# Altium project Proximitor Signal Conditioner.PrjPcb
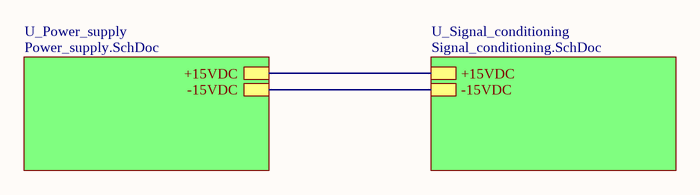
[diagram p0: Proximitor Signal Conditioner.SchDoc]
3 sheets, 63 parts. Net scope: hierarchical (ports join the sheet entries above them; power ports are global).
Board file: Processing_Unit.PcbDoc
Sheets:
  Proximitor Signal Conditioner.SchDoc
    U_Power_supply = Power_supply.SchDoc
    U_Signal_conditioning = Signal_conditioning.SchDoc

## Sheet Proximitor Signal Conditioner.SchDoc
size A4; SheetNumber: 1; SheetTotal: 3

### Sub-sheets
U_Power_supply = Power_supply.SchDoc: +15VDC, -15VDC
U_Signal_conditioning = Signal_conditioning.SchDoc: +15VDC, -15VDC

### Nets
+15VDC: sheet U_Power_supply/+15VDC, sheet U_Signal_conditioning/+15VDC
-15VDC: sheet U_Power_supply/-15VDC, sheet U_Signal_conditioning/-15VDC

## Sheet Power_supply.SchDoc
size A4; SheetNumber: 2; SheetTotal: 3
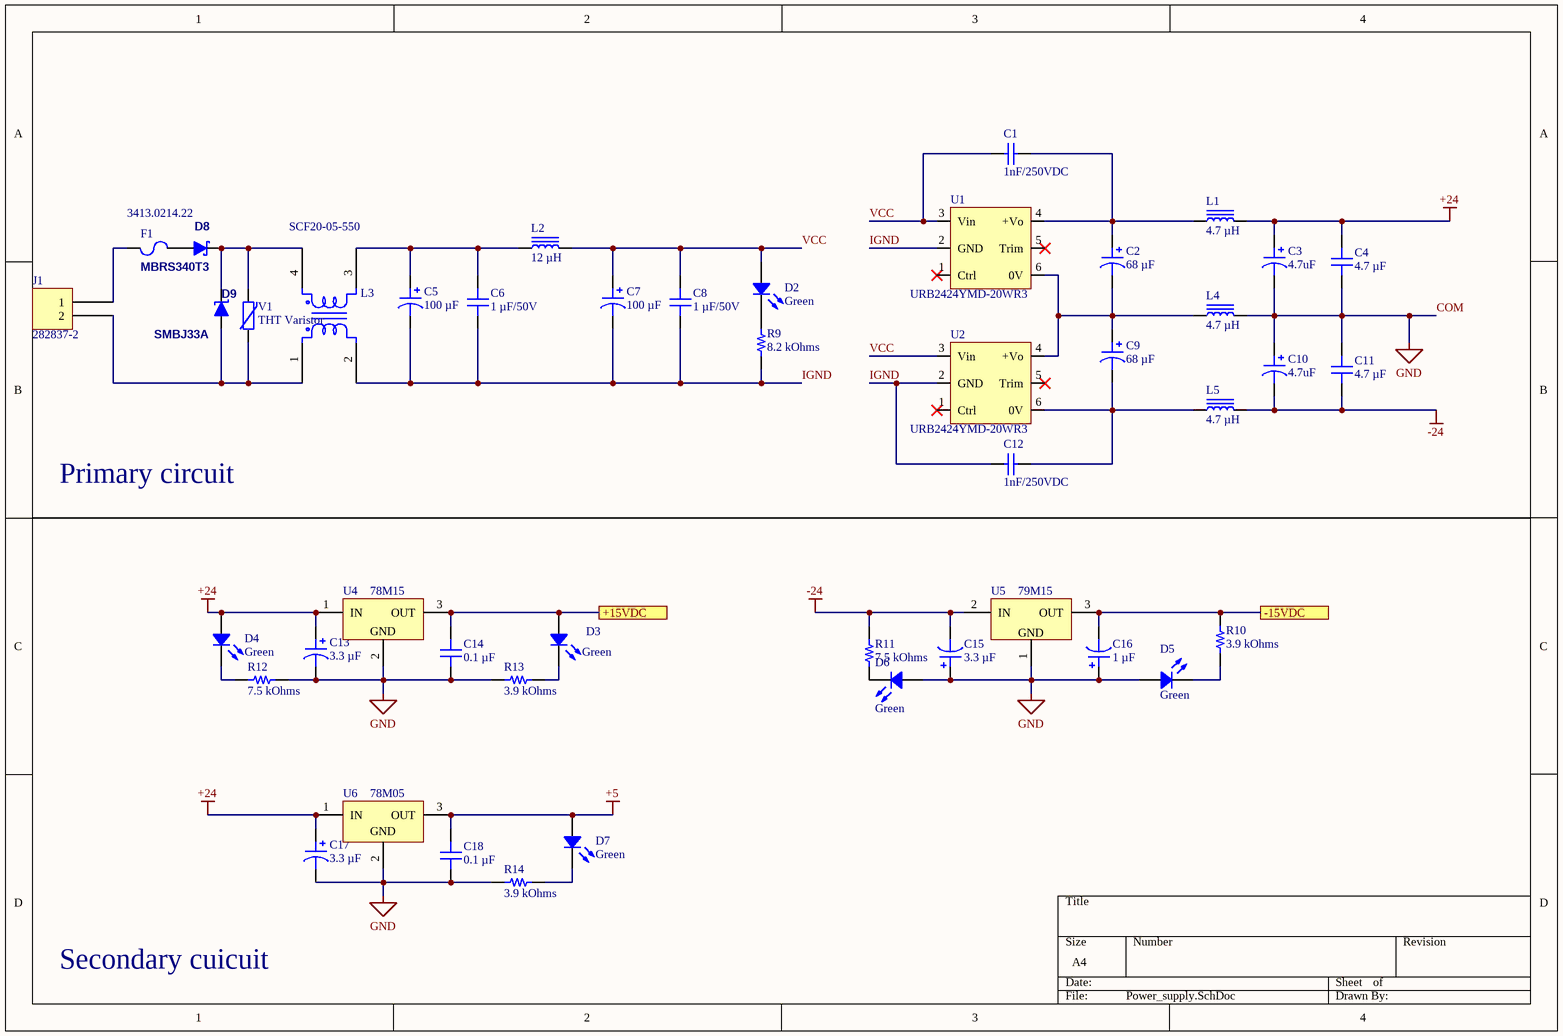
[diagram p1: Power_supply.SchDoc]

### Parts
C1  1nF/250VDC  [SIOV-S07K11]
C2  68 µF  [CAP ALSMD 8.3MM H10.5MM]
C3  4.7uF  [CAP ALSMD 8.3MM H10.5MM]
C4  4.7 µF  [CAP 1210_3225 - 1MM]
C5  100 µF  [CAP ALSMD 8.3MM H10.5MM]
C6  Capacitance: 1 µF/50V  [CAP 1206_3216 - 0.8MM]  (hidden comment: 4.7 µF)
C7  100 µF  [CAP ALSMD 8.3MM H10.5MM]
C8  Capacitance: 1 µF/50V  [CAP 1206_3216 - 0.8MM]  (hidden comment: 4.7 µF)
C9  68 µF  [CAP ALSMD 8.3MM H10.5MM]
C10  4.7uF  [CAP ALSMD 8.3MM H10.5MM]
C11  4.7 µF  [CAP 1210_3225 - 1MM]
C12  1nF/250VDC  [SIOV-S07K11]
C13  3.3 µF  [CAP ALSMD 4.3MM H5.4MM]
C14  0.1 µF  [CAP 0603_1608]
C15  3.3 µF  [CAP ALSMD 4.3MM H5.4MM]
C16  1 µF  [CAP ALSMD 4.3MM H5.4MM]
C17  3.3 µF  [CAP ALSMD 4.3MM H5.4MM]
C18  0.1 µF  [CAP 0603_1608]
D2  Green  [LED 0603_1608 GREEN]
D3  Green  [LED 0603_1608 GREEN]
D4  Green  [LED 0603_1608 GREEN]
D5  Green  [LED 0603_1608 GREEN]
D6  Green  [LED 0603_1608 GREEN]
D7  Green  [LED 0603_1608 GREEN]
D8  MBRS340T3  [SMC]
D9  SMBJ33A  [SMB]
F1  3413.0214.22  [FUSE 1206_3216 0.6MM]
J1  282837-2  [TE 282837-2]
L1  4.7 µH  [BOURNS SRP5030T]
L2  12 µH  [BOURNS SRR1280]
L3  SCF20-05-550  [KEMET SCF20-05-550]
L4  4.7 µH  [BOURNS SRP5030T]
L5  4.7 µH  [BOURNS SRP5030T]
R9  8.2 kOhms  [RES 0805_2012]
R10  3.9 kOhms  [RES 0805_2012]
R11  7.5 kOhms  [RES 0805_2012]
R12  7.5 kOhms  [RES 0805_2012]
R13  3.9 kOhms  [RES 0805_2012]
R14  3.9 kOhms  [RES 0805_2012]
U1  URB2424YMD-20WR3  [URB_YMD-20WR3]
U2  URB2424YMD-20WR3  [URB_YMD-20WR3]
U4  78M15  [TO252]
U5  79M15  [TO252]
U6  78M05  [TO252]
V1  THT Varistor  [SIOV-S07K11]

### Ports
+15VDC, -15VDC

### Nets
+5: C18.2 D7.1 U6.3(OUT)
+24: C3.1 C4.2 C13.1 C17.1 D4.1 L1.2 U4.1(IN) U6.1(IN)
-24: C10.2 C11.1 C15.2 L5.2 R11.2 U5.2(IN)
COM: C3.2 C4.1 C10.1 C11.2 C13.2 C14.1 C15.1 C16.1 C17.2 C18.1 D5.1 D6.1 L4.2 R12.2 R13.1 R14.1 U4.2(GND) U5.1(GND) U6.2(GND)  [also labelled GND]
+15VDC: C14.2 D3.1 U4.3(OUT) ; port +15VDC
-15VDC: C16.2 R10.2 U5.3(OUT) ; port -15VDC
IGND: C5.2 C6.1 C7.2 C8.1 C12.2 L3.2 R9.1 U1.2(GND) U2.2(GND)
VCC: C1.2 C7.1 C8.2 D2.1 L2.2 U1.3(Vin) U2.3(Vin)
NetC1_1: C1.1 C2.1 L1.1 U1.4(+Vo)
NetC2_2: C2.2 C9.1 L4.1 U1.6(0V) U2.4(+Vo)
NetC5_1: C5.1 C6.2 L2.1 L3.3
NetC9_2: C9.2 C12.1 L5.1 U2.6(0V)
NetD2_2: D2.2 R9.2
NetD3_2: D3.2 R13.2
NetD4_2: D4.2 R12.1
NetD5_2: D5.2 R10.1
NetD6_2: D6.2 R11.1
NetD7_2: D7.2 R14.2
NetD8_1: D8.1(A) F1.2
NetD8_2: D8.2(K) D9.2(K) L3.4 V1.2
NetD9_1: D9.1(A) J1.2 L3.1 V1.1
NetF1_1: F1.1 J1.1

Not connected (* = marked no-connect by the designer): U1 1(Ctrl)* 5(Trim)*; U2 1(Ctrl)* 5(Trim)*

### Notes on the sheet
- Primary circuit
- Secondary cuicuit

### Library data of the parts
C1 C12 = Y safety capacitor: pitch 7.5 mm
C2 C9 = 865060653009: CAP ALUM 68UF 20% 50V SMD; manufacturer: Würth Elektronik; Impedance: 340 mOhms; Lifetime @ Temp.: 5000 Hrs @ 105°C; Polarization: Polar; Ripple Current @ High Frequency: 300 mA @ 100 kHz; Ripple Current @ Low Frequency: 195 mA @ 120 Hz; Surface Mount Land Size: 0.327" L x 0.327" W (8.30mm x 8.30mm); Part Number: 865060653009; Applications: General Purpose; Capacitance: 68 µF; componentlink1description: Datasheet; componentlink1url: https://katalog.we-online.de/pbs/datasheet/865060653009.pdf; componentlink2description: DigiKey Link; componentlink2url: https://www.digikey.com/en/products/detail/würth-elektronik/865060653009/5728144; Device Package: Radial, Can - SMD; Height - Seated (Max): 0.413" (10.50mm); lastupdated: 4/5/2026 8:53:58 PM; Lifecycle Status: Active; Minimum Order: 1; Mounting Type: Surface Mount; Operating Temperature: -55°C ~ 105°C; Package / Case: Radial, Can - SMD; packaging: TapeAndReel; partid: 7468; Part Status: Active; price: 0.36; series: WCAP-ASLL; Size / Dimension: 0.315" Dia (8.00mm); Supplier 1: DigiKey; Supplier Part Number 1: 732-8549-1-ND; Tolerance: ±20%; value: 68 µF; Voltage - Rated: 50 V
C3 C10 = UCX1H470MCS1GS: CAP ALUM 47UF 20% 50V SMD; manufacturer: Nichicon; Capacitance: 47µF; ESR (Equivalent Series Resistance): 250mOhm; Lifetime @ Temp.: 2000 Hrs @ 135°C; Polarization: Polar; Ripple Current @ High Frequency: 270mA @ 100kHz; Ripple Current @ Low Frequency: 135mA @ 120Hz; Surface Mount Land Size: 0.327" L x 0.327" W (8.30mm x 8.30mm); value: 47µF; Part Number: UCX1H470MCS1GS; Applications: General Purpose; componentlink1description: Datasheet; componentlink1url: http://nichicon-us.com/english/products/pdfs/e-ucx.pdf; componentlink2description: DigiKey Link; componentlink2url: http://digikey.com/product-detail/en/nichicon/UCX1H470MCS1GS/493-13624-1-ND/4695062; Device Package: Radial, Can - SMD; Height - Seated (Max): 0.413" (10.50mm); lastupdated: 9/2/2020 1:25:13 AM; Lifecycle Status: Active; Minimum Order: 1; Mounting Type: Surface Mount; Operating Temperature: -40°C ~ 135°C; Package / Case: Radial, Can - SMD; packaging: TapeAndReel; partid: 7791; Part Status: Active; price: 0.48; series: UCX; Size / Dimension: 0.315" Dia (8.00mm); Supplier 1: DigiKey; Supplier Part Number 1: 493-13624-1-ND; Tolerance: ±20%; Voltage - Rated: 50V
C4 C11 = CNC6P1X7R2A475K250AE: CAP 1210 X7R 100V 4.7UF 10% 2.50; manufacturer: TDK Corporation; Part Number: CNC6P1X7R2A475K250AE; Value: 4.7 µF; Applications: Boardflex Sensitive; Capacitance: 4.7 µF; componentlink1description: Datasheet; componentlink1url: https://product.tdk.com/info/en/catalog/datasheets/mlcc_commercial_soft_cnc_en.pdf?ref_disty=digikey; componentlink2description: DigiKey Link; componentlink2url: https://www.digikey.com/en/products/detail/tdk-corporation/CNC6P1X7R2A475K250AE/10240634; Device Package: 1210 (3225 Metric); Features: Soft Termination; lastupdated: 4/6/2026 7:45:52 PM; Lifecycle Status: Active; Minimum Order: 1; Mounting Type: Surface Mount, MLCC; Operating Temperature: -55°C ~ 125°C; Package / Case: 1210 (3225 Metric); packaging: TapeAndReel; partid: 23689; Part Status: Active; price: 0.44; series: CNC; Size / Dimension: 0.126" L x 0.098" W (3.20mm x 2.50mm); Supplier 1: DigiKey; Supplier Part Number 1: 445-181657-1-ND; Temperature Coefficient: X7R; Thickness (Max): 0.110" (2.80mm); Tolerance: ±10%; Voltage - Rated: 100V
C5 C7 = UWT1H101MNL1GS: CAP ALUM 100UF 20% 50V SMD; manufacturer: Nichicon; Lifetime @ Temp.: 1000 Hrs @ 105°C; Polarization: Polar; Ripple Current @ High Frequency: 210 mA @ 10 kHz; Ripple Current @ Low Frequency: 140 mA @ 120 Hz; Surface Mount Land Size: 0.327" L x 0.327" W (8.30mm x 8.30mm); Part Number: UWT1H101MNL1GS; Applications: General Purpose; Capacitance: 100 µF; componentlink1description: Datasheet; componentlink1url: https://products.nichicon.co.jp/en/pdf/XJA043/e-uwt.pdf; componentlink2description: DigiKey Link; componentlink2url: https://www.digikey.com/en/products/detail/nichicon/UWT1H101MNL1GS/589967; Device Package: Radial, Can - SMD; Height - Seated (Max): 0.413" (10.50mm); lastupdated: 4/5/2026 8:53:58 PM; Lifecycle Status: Active; Minimum Order: 1; Mounting Type: Surface Mount; Operating Temperature: -55°C ~ 105°C; Package / Case: Radial, Can - SMD; packaging: TapeAndReel; partid: 7453; Part Status: Active; price: 0.12; Ratings: AEC-Q200; series: UWT; Size / Dimension: 0.315" Dia (8.00mm); Supplier 1: DigiKey; Supplier Part Number 1: 493-2226-1-ND; Tolerance: ±20%; value: 100 µF; Voltage - Rated: 50 V
C6 C8 = GRM31CC72A475KE11K: CAP CER 4.7UF 100V X7S 1206; manufacturer: Murata Electronics; Tolerance: ±10%; Part Number: GRM31CC72A475KE11K; Applications: General Purpose; componentlink1description: Datasheet; componentlink1url: https://search.murata.co.jp/Ceramy/image/img/A01X/G101/ENG/GRM31CC72A475KE11-01.pdf; componentlink2description: DigiKey Link; componentlink2url: https://www.digikey.com/en/products/detail/murata-electronics/GRM31CC72A475KE11K/13904926; Device Package: 1206 (3216 Metric); lastupdated: 4/6/2026 7:36:55 PM; Lifecycle Status: Active; Minimum Order: 1; Mounting Type: Surface Mount, MLCC; Operating Temperature: -55°C ~ 125°C; Package / Case: 1206 (3216 Metric); packaging: TapeAndReel; partid: 30045; Part Status: Active; price: 0.19; series: GRM; Size / Dimension: 0.126" L x 0.063" W (3.20mm x 1.60mm); Supplier 1: DigiKey; Supplier Part Number 1: 490-GRM31CC72A475KE11KCT-ND; Temperature Coefficient: X7S; Thickness (Max): 0.075" (1.90mm); value: 4.7 µF; Voltage - Rated: 100V
C13 C15 C17 = EEE-FC1V3R3R: CAP ALUM 3.3UF 20% 35V SMD; manufacturer: Panasonic Electronic Components; Impedance: 3 Ohms; Lifetime @ Temp.: 1000 Hrs @ 105°C; Polarization: Polar; Ripple Current @ High Frequency: 60 mA @ 100 kHz; Ripple Current @ Low Frequency: 45 mA @ 120 Hz; Surface Mount Land Size: 0.169" L x 0.169" W (4.30mm x 4.30mm); Part Number: EEE-FC1V3R3R; Applications: Automotive; Capacitance: 3.3 µF; componentlink1description: Datasheet; componentlink1url: https://industrial.panasonic.com/cdbs/www-data/pdf/RDE0000/ABA0000C1172.pdf; componentlink2description: DigiKey Link; componentlink2url: https://www.digikey.com/en/products/detail/panasonic-electronic-components/EEE-FC1V3R3R/817439; Device Package: Radial, Can - SMD; Height - Seated (Max): 0.213" (5.40mm); lastupdated: 4/5/2026 8:29:52 PM; Lifecycle Status: Active; Minimum Order: 1; Mounting Type: Surface Mount; Operating Temperature: -40°C ~ 105°C; Package / Case: Radial, Can - SMD; packaging: TapeAndReel; partid: 7059; Part Status: Active; price: 0.11; Ratings: AEC-Q200; series: FC; Size / Dimension: 0.157" Dia (4.00mm); Supplier 1: DigiKey; Supplier Part Number 1: PCE4030CT-ND; Tolerance: ±20%; value: 3.3 µF; Voltage - Rated: 35 V
C14 C18 = C0603C104M5RAC7867: CAP CER 0.1UF 50V X7R 0603; manufacturer: KEMET; Tolerance: ±20%; Part Number: C0603C104M5RAC7867; Capacitance: 0.1 µF; Applications: Bypass, Decoupling; componentlink1description: Datasheet; componentlink1url: https://api.kemet.com/component-edge/download/datasheet/C0603C104M5RACTU.pdf; componentlink2description: DigiKey Link; componentlink2url: https://www.digikey.com/en/products/detail/kemet/C0603C104M5RAC7867/2199782; Device Package: 0603 (1608 Metric); lastupdated: 4/6/2026 7:22:26 PM; Lifecycle Status: Active; Minimum Order: 1; Mounting Type: Surface Mount, MLCC; Operating Temperature: -55°C ~ 125°C; Package / Case: 0603 (1608 Metric); packaging: TapeAndReel; partid: 35320; Part Status: Active; price: 0.01; series: SMD Comm X7R; Size / Dimension: 0.063" L x 0.031" W (1.60mm x 0.80mm); Supplier 1: DigiKey; Supplier Part Number 1: 399-C0603C104M5RAC7867CT-ND; Temperature Coefficient: X7R; Thickness (Max): 0.034" (0.87mm); value: 0.1 µF; Voltage - Rated: 50V
C16 = EEE-1HA010NR: CAP ALUM 1UF 20% 50V SMD; manufacturer: Panasonic Electronic Components; Lifetime @ Temp.: 2000 Hrs @ 85°C; Polarization: Bi-Polar; Ripple Current @ High Frequency: 17 mA @ 10 kHz; Ripple Current @ Low Frequency: 10 mA @ 120 Hz; Surface Mount Land Size: 0.169" L x 0.169" W (4.30mm x 4.30mm); Part Number: EEE-1HA010NR; Applications: Automotive; Capacitance: 1 µF; componentlink1description: Datasheet; componentlink1url: //media.digikey.com/pdf/Data%20Sheets/Panasonic%20Electronic%20Components/S_Series,Type_V_Rev2018.pdf; componentlink2description: DigiKey Link; componentlink2url: https://www.digikey.com/en/products/detail/panasonic-electronic-components/EEE-1HA010NR/946216; Device Package: Radial, Can - SMD; Height - Seated (Max): 0.213" (5.40mm); lastupdated: 4/5/2026 8:29:53 PM; Lifecycle Status: Active; Minimum Order: 1; Mounting Type: Surface Mount; Operating Temperature: -40°C ~ 85°C; Package / Case: Radial, Can - SMD; packaging: TapeAndReel; partid: 7035; Part Status: Active; price: 0.07; Ratings: AEC-Q200; series: S; Size / Dimension: 0.157" Dia (4.00mm); Supplier 1: DigiKey; Supplier Part Number 1: PCE4301CT-ND; Tolerance: ±20%; value: 1 µF; Voltage - Rated: 50 V
D2-D7 = LSM0603453V: LED GREEN CLEAR CHIP 0603 SMD; Manufacturer: Visual Communications Company - VCC; Configuration: Standard; Current - Test: 20mA; Lens Color: Colorless; Lens Size: 1.20mm x 0.80mm; Lens Style: Rectangle with Flat Top; Millicandela Rating: 63mcd; Viewing Angle: 120°; Voltage - Forward (Vf) (Typ): 2V; Wavelength - Dominant: 572nm; Wavelength - Peak: 571nm; Part Number: LSM0603453V; Color: Green; ComponentLink1Description: Datasheet; ComponentLink1URL: https://vcclite.com/wp-content/uploads/wpallimport/files/files/LSM0603453V.pdf; ComponentLink2Description: DigiKey Link; ComponentLink2URL: https://www.digikey.com/en/products/detail/visual-communications-company-vcc/LSM0603453V/9486724; Device Package: 0603 (1608 Metric); Height (Max): 0.65mm; LastUpdated: 4/5/2026 20:36:38; Lens Transparency: Clear; Lifecycle Status: Active; Minimum Order: 1; Mounting Type: Surface Mount; Package / Case: 0603 (1608 Metric); Packaging: TapeAndReel; PartId: 579; Part Status: Active; Price: 0.09; Series: LSM0603; Size / Dimension: 1.60mm L x 0.80mm W; Supplier 1: DigiKey; Supplier Part Number 1: LSM0603453VCT-ND; Supplier Device Package: Chip LED; Value: Green
D8 = MBRS340T3: Schottky barrier rectifier: 40V, 3A; Published: 30-Jun-2006; PackageReference: SMC; Supplier 1: TME; Supplier 2: Farnell; Supplier 3: Farnell; Supplier Part Number 1: MBRS340T3; Supplier Part Number 2: 2323112; Supplier Part Number 3: 2323120
D9 = SMBJ33A: 33V, 600W Surface Mount Transient Voltage Suppression Diode, SMBJ Series; Supplier 1: Farnell; Supplier 2: Farnell; Supplier 3: TME; Supplier 4: Farnell; Supplier 5: TME; Supplier 6: Farnell; Supplier 7: Farnell; Supplier Part Number 1: 9886257; Supplier Part Number 2: 2252485; Supplier Part Number 3: SMBJ33A-TR; Supplier Part Number 4: 9886257RL; Supplier Part Number 5: SMBJ33A-LF; Supplier Part Number 6: 9844015; Supplier Part Number 7: 9844015RL
F1 = 3413.0214.22: FUSE BOARD MNT 630MA 32VAC 63VDC; Manufacturer: Schurter Inc.; Approval Agency: cURus, VDE; Breaking Capacity @ Rated Voltage: 63A; Fuse Type: Board Mount (Cartridge Style Excluded); Melting I²t: 0.076; Response Time: Fast Blow; Voltage Rating - AC: 32V; Voltage Rating - DC: 63V; Part Number: 3413.0214.22; Approvals: cURus, VDE; ComponentLink1Description: Datasheet; ComponentLink1URL: https://us.schurter.com/pdf/english/typ_USI_1206.pdf; ComponentLink2Description: DigiKey Link; ComponentLink2URL: http://digikey.com/product-detail/en/schurter-inc/3413.0214.22/486-1142-1-ND/1522974; Current Rating (Amps): 630mA; Device Package: 1206 (3216 Metric); LastUpdated: 9/2/2020 1:30:41 AM; Lifecycle Status: Active; Minimum Order: 1; Mounting Type: Surface Mount; Operating Temperature: -55°C ~ 90°C; Package / Case: 1206 (3216 Metric); Packaging: TapeAndReel; Part Status: Active; Price: 0.26; Series: USI 1206; Size / Dimension: 0.126" L x 0.063" W x 0.024" H (3.20mm x 1.60mm x 0.60mm); Supplier 1: DigiKey; Supplier Part Number 1: 486-1142-1-ND
J1 = 282837-2: TERM BLK 2P SIDE ENT 5.08MM PCB; Manufacturer: TE Connectivity AMP Connectors; Current: 13.5 A; Mating Orientation: Horizontal with Board; Number of Levels: 1; Pitch: 0.200" (5.08mm); Positions Per Level: 2; Voltage: 300 V; Wire Gauge: 16-28 AWG; Wire Termination: Screw - Rising Cage Clamp; Part Number: 282837-2; Color: Green; ComponentLink1Description: Datasheet; ComponentLink1URL: https://www.te.com/commerce/DocumentDelivery/DDEController?Action=srchrtrv&DocNm=282837&DocType=Customer+Drawing&DocLang=English; ComponentLink2Description: DigiKey Link; ComponentLink2URL: https://www.digikey.com/en/products/detail/te-connectivity-amp-connectors/282837-2/2187973; Features: Interlocking (Side); LastUpdated: 6/21/2022 3:00:23 PM; Lifecycle Status: Active; Minimum Order: 1; Mounting Type: Through Hole; Packaging: Tray; Part Status: Active; Price: 0.31; Series: Buchanan; Supplier 1: DigiKey; Supplier Part Number 1: A113320-ND
L1 L4 L5 = SRP5030T-4R7M: FIXED IND 4.7UH 4.6A 53 MOHM SMD; Manufacturer: Bourns Inc.; Current - Saturation: 6A; DC Resistance (DCR): 53mOhm Max; Inductance Frequency - Test: 100 kHz; Material - Core: Iron Powder; Shielding: Shielded; Tolerance: ±20%; Type: Drum Core, Wirewound; Part Number: SRP5030T-4R7M; ComponentLink1Description: Datasheet; ComponentLink1URL: https://www.bourns.com/docs/Product-Datasheets/SRP5030T.pdf; ComponentLink2Description: DigiKey Link; ComponentLink2URL: https://www.digikey.com/en/products/detail/bourns-inc/SRP5030T-4R7M/3986084; Current Rating (Amps): 4.6 A; Device Package: Nonstandard; Height - Seated (Max): 0.118" (3.00mm); Inductance: 4.7 µH; LastUpdated: 4/5/2026 8:41:42 PM; Lifecycle Status: Active; Minimum Order: 1; Mounting Type: Surface Mount; Operating Temperature: -40°C ~ 125°C; Package / Case: Nonstandard; Packaging: TapeAndReel; PartId: 1; Part Status: Active; Price: 0.52; Series: SRP5030T; Size / Dimension: 0.224" L x 0.205" W (5.70mm x 5.20mm); Supplier 1: DigiKey; Supplier Part Number 1: SRP5030T-4R7MCT-ND; Value: 4.7 µH
L2 = SRR1280-120M: FIXED IND 12UH 5.6A 28 MOHM SMD; Manufacturer: Bourns Inc.; Current - Saturation: 6.6A; DC Resistance (DCR): 28mOhm Max; Frequency - Self Resonant: 15MHz; Inductance Frequency - Test: 100 kHz; Material - Core: Ferrite; Q @ Freq: 26 @ 2.52MHz; Shielding: Shielded; Tolerance: ±20%; Type: Drum Core, Wirewound; Part Number: SRR1280-120M; ComponentLink1Description: Datasheet; ComponentLink1URL: https://www.bourns.com/docs/Product-Datasheets/SRR1280.pdf; ComponentLink2Description: DigiKey Link; ComponentLink2URL: https://www.digikey.com/en/products/detail/bourns-inc/SRR1280-120M/1969993; Current Rating (Amps): 5.6 A; Device Package: Nonstandard; Height - Seated (Max): 0.315" (8.00mm); Inductance: 12 µH; LastUpdated: 4/5/2026 8:41:43 PM; Lifecycle Status: Active; Minimum Order: 1; Mounting Type: Surface Mount; Operating Temperature: -40°C ~ 125°C; Package / Case: Nonstandard; Packaging: TapeAndReel; PartId: 40; Part Status: Active; Price: 0.45; Series: SRR1280; Size / Dimension: 0.492" L x 0.492" W (12.50mm x 12.50mm); Supplier 1: DigiKey; Supplier Part Number 1: SRR1280-120MCT-ND; Value: 12 µH
L3 = SCF20-05-550: CMC 5.5MH 5A 2LN TH; Manufacturer: KEMET; DC Resistance (DCR) (Max): 28mOhm; Filter Type: Power Line; Inductance @ Frequency: 5.5mH @ 10kHz; Number of Lines: 2; Voltage Rating - AC: 250V; Part Number: SCF20-05-550; ComponentLink1Description: Datasheet; ComponentLink1URL: https://api.kemet.com/component-edge/download/datasheet/SCF20-05-550.pdf; ComponentLink2Description: DigiKey Link; ComponentLink2URL: http://digikey.com/product-detail/en/kemet/SCF20-05-550/399-10780-ND/4290846; Current Rating (Max): 5A; Height (Max): 0.984" (25.00mm); LastUpdated: 8/19/2023 4:18:52 AM; Lifecycle Status: Active; Minimum Order: 1; Mounting Type: Through Hole; Operating Temperature: -25°C ~ 120°C; Package / Case: Vertical, No Base, 4 PC Pin; Packaging: Bulk; Part Status: Active; Price: 7.23; Series: SC; Size / Dimension: 0.984" L x 0.610" W (25.00mm x 15.50mm); Supplier 1: DigiKey; Supplier Part Number 1: 399-10780-ND; Voltage Rating - DC: 250V
R9 = ERJ-PB6D8201V: RES SMD 8.2K OHM 0.5% 1/4W 0805; Manufacturer: Panasonic Electronic Components; Power (Watts): 0.25W, 1/4W; Temperature Coefficient: ±50ppm/°C; Part Number: ERJ-PB6D8201V; Value: 8.2 kOhms; ComponentLink1Description: Datasheet; ComponentLink1URL: https://industrial.panasonic.com/cdbs/www-data/pdf/RDM0000/AOA0000C328.pdf; ComponentLink2Description: DigiKey Link; ComponentLink2URL: https://www.digikey.com/en/products/detail/panasonic-electronic-components/ERJ-PB6D8201V/6213906; Composition: Thick Film; Device Package: 0805 (2012 Metric); Features: Automotive AEC-Q200; Height - Seated (Max): 0.028" (0.70mm); LastUpdated: 4/5/2026 20:11:26; Lifecycle Status: Active; Minimum Order: 1; Number of Terminations: 2; Operating Temperature: -55°C ~ 155°C; Package / Case: 0805 (2012 Metric); Packaging: TapeAndReel; PartId: 27742; Part Status: Active; Price: 0.02; Ratings: AEC-Q200; Resistance: 8.2 kOhms; Series: ERJ-PB6; Size / Dimension: 0.079" L x 0.049" W (2.00mm x 1.25mm); Supplier 1: DigiKey; Supplier Part Number 1: P21123CT-ND; Supplier Device Package: 0805; Tolerance: ±0.5%
R10 R13 R14 = CRGP0805F3K9: RES 3.9K OHM 1% 1/3W 0805; Manufacturer: TE Connectivity Passive Product; Power (Watts): 0.333W, 1/3W; Temperature Coefficient: ±100ppm/°C; Part Number: CRGP0805F3K9; Value: 3.9 kOhms; ComponentLink1Description: Datasheet; ComponentLink1URL: https://www.te.com/commerce/DocumentDelivery/DDEController?Action=srchrtrv&DocNm=9-1773463-9&DocType=DS&DocLang=English; ComponentLink2Description: DigiKey Link; ComponentLink2URL: https://www.digikey.com/en/products/detail/te-connectivity-passive-product/CRGP0805F3K9/8577086; Composition: Thick Film; Device Package: 0805 (2012 Metric); Features: Pulse Withstanding; Height - Seated (Max): 0.026" (0.65mm); LastUpdated: 4/5/2026 20:11:22; Lifecycle Status: Active; Minimum Order: 1; Number of Terminations: 2; Operating Temperature: -55°C ~ 155°C; Package / Case: 0805 (2012 Metric); Packaging: TapeAndReel; PartId: 28771; Part Status: Active; Price: 0.02; Resistance: 3.9 kOhms; Series: CRGP; Size / Dimension: 0.079" L x 0.049" W (2.00mm x 1.25mm); Supplier 1: DigiKey; Supplier Part Number 1: A130484CT-ND; Supplier Device Package: 0805; Tolerance: ±1%
R11 R12 = RN73C2A7K5BTDF: RES SMD 7.5K OHM 0.1% 1/10W 0805; Manufacturer: TE Connectivity Passive Product; Power (Watts): 0.1W, 1/10W; Temperature Coefficient: ±10ppm/°C; Part Number: RN73C2A7K5BTDF; Value: 7.5 kOhms; ComponentLink1Description: Datasheet; ComponentLink1URL: https://www.te.com/commerce/DocumentDelivery/DDEController?Action=srchrtrv&DocNm=1773270&DocType=DS&DocLang=English; ComponentLink2Description: DigiKey Link; ComponentLink2URL: https://www.digikey.com/en/products/detail/te-connectivity-passive-product/RN73C2A7K5BTDF/2373863; Composition: Thin Film; Device Package: 0805 (2012 Metric); Height - Seated (Max): 0.026" (0.65mm); LastUpdated: 4/5/2026 20:11:25; Lifecycle Status: Active; Minimum Order: 1; Number of Terminations: 2; Operating Temperature: -55°C ~ 155°C; Package / Case: 0805 (2012 Metric); Packaging: TapeAndReel; PartId: 27913; Part Status: Active; Price: 0.36; Resistance: 7.5 kOhms; Series: RN73, Holsworthy; Size / Dimension: 0.079" L x 0.049" W (2.00mm x 1.25mm); Supplier 1: DigiKey; Supplier Part Number 1: A103510CT-ND; Supplier Device Package: 0805; Tolerance: ±0.1%
U1 U2 = URB_YMD-20WR3: Isolated DC-DC Converter
U4 = 78M15: SMD
U5 = 79M15: SMD
U6 = 78M05: SMD; Don_Vi: Con; Ten_Linh_Kien: 78M05 TO252; Ma_Hang: MH001917; Chung_Loai: Dán; Ghi_Chu: *; Kieu_Chan: *
V1 = VaristorTHT: Published: 19-Feb-2006; Value: *

## Sheet Signal_conditioning.SchDoc
size A4; SheetNumber: 3; SheetTotal: 3
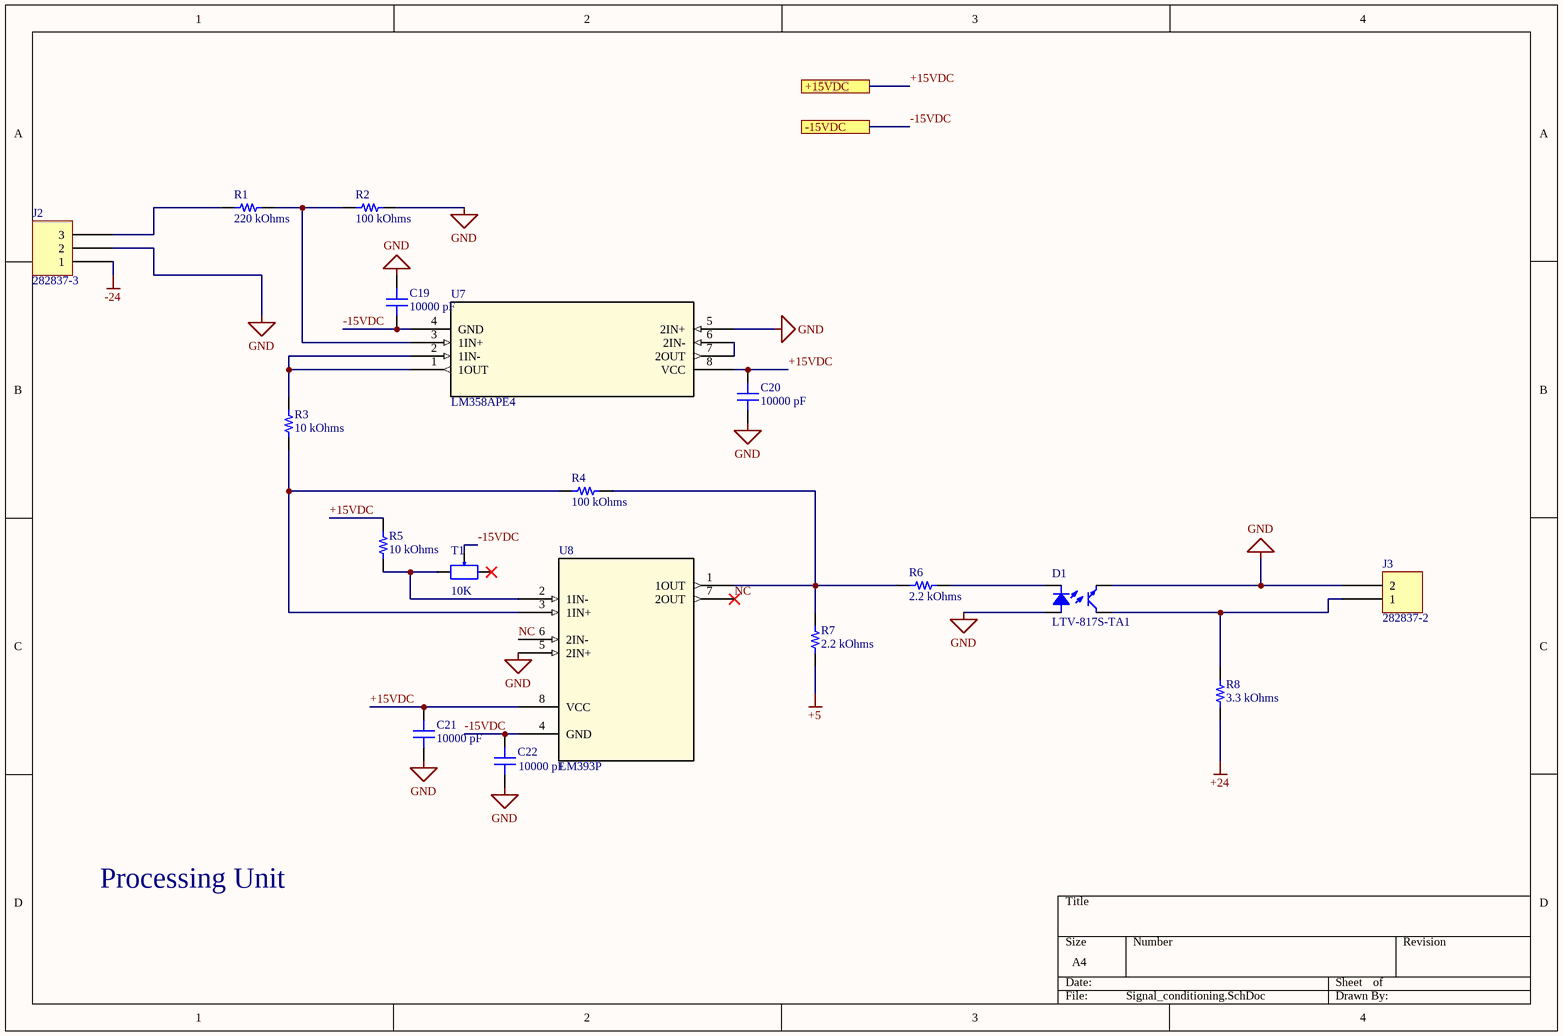
[diagram p2: Signal_conditioning.SchDoc]

### Parts
C19  10000 pF  [CAP 0805_2012]
C20  10000 pF  [CAP 0805_2012]
C21  10000 pF  [CAP 0805_2012]
C22  10000 pF  [CAP 0805_2012]
D1  LTV-817S-TA1  [LITEON LTV-817]
J2  282837-3  [TE 282837-3]
J3  282837-2  [TE 282837-2]
R1  220 kOhms  [RES 1206_3216]
R2  100 kOhms  [RES 1206_3216]
R3  10 kOhms  [RES 1206_3216]
R4  100 kOhms  [RES 1206_3216]
R5  10 kOhms  [RES 1206_3216]
R6  2.2 kOhms  [RES 1206_3216]
R7  2.2 kOhms  [RES 1206_3216]
R8  3.3 kOhms  [RES 1206_3216]
T1  10K  [Bien Tro Vi Chinh Dung]
U7  LM358APE4  [P8]
U8  LM393P  [P8]

### Ports
+15VDC, -15VDC

### Nets
+5: R7.1
+24: R8.1
-24: J2.1
GND: C19.1 C20.2 C21.2 C22.2 D1.1 D1.3 J2.2 J3.2 R2.2 U7.5(2IN+) U8.5(2IN+)  [project net COM]
+15VDC: C20.1 C21.1 R5.1 U7.8(VCC) U8.8(VCC) ; port +15VDC
-15VDC: C19.2 C22.1 T1.2 U7.4(GND) U8.4(GND) ; port -15VDC
NC: U8.6(2IN-) U8.7(2OUT)
NetD1_2: D1.2 R6.2
NetD1_4: D1.4 J3.1 R8.2
NetJ2_3: J2.3 R1.1
NetR1_2: R1.2 R2.1 U7.3(1IN+)
NetR3_1: R3.1 R4.1 U8.3(1IN+)
NetR3_2: R3.2 U7.1(1OUT) U7.2(1IN-)
NetR4_2: R4.2 R6.1 R7.2 U8.1(1OUT)
NetR5_2: R5.2 T1.1 U8.2(1IN-)
NetU7_6: U7.6(2IN-) U7.7(2OUT)

Not connected (* = marked no-connect by the designer): T1 3*

### Notes on the sheet
- Processing Unit

### Library data of the parts
C19-C22 = C0805C103F3GEC7800: CAP CER 0805 10NF 25V C0G 1%; manufacturer: KEMET; Temperature Coefficient: C0G, NP0; Part Number: C0805C103F3GEC7800; Capacitance: 10000 pF; Applications: ESD Protection; componentlink1description: Datasheet; componentlink1url: https://connect.kemet.com:7667/gateway/IntelliData-ComponentDocumentation/1.0/download/datasheet/C0805C103F3GEC7800; componentlink2description: DigiKey Link; componentlink2url: https://www.digikey.com/en/products/detail/kemet/C0805C103F3GEC7800/8644419; Device Package: 0805 (2012 Metric); Features: Low ESL, Low ESR; lastupdated: 4/6/2026 19:29:19; Lifecycle Status: Active; Minimum Order: 1; Mounting Type: Surface Mount, MLCC; Operating Temperature: -55°C ~ 125°C; Package / Case: 0805 (2012 Metric); packaging: TapeAndReel; partid: 72904; price: 0.43; series: ESD SMD Comm C0G; Size / Dimension: 0.079" L x 0.049" W (2.00mm x 1.25mm); Supplier 1: DigiKey; Supplier Part Number 1: 399-C0805C103F3GEC7800CT-ND; Thickness (Max): 0.039" (1.00mm); Tolerance: ±1%; value: 10000 pF; Voltage - Rated: 25V
D1 = LTV-817S-TA1: OPTOISOLATR 5KV TRANSISTOR 4-SMD; Manufacturer: Lite-On Inc.; Current - DC Forward (If) (Max): 50mA; Current Transfer Ratio (Max): 600% @ 5mA; Current Transfer Ratio (Min): 50% @ 5mA; Input Type: DC; Number of Channels: 1; Rise / Fall Time (Typ): 4µs, 3µs; Vce Saturation (Max): 200mV; Voltage - Forward (Vf) (Typ): 1.2V; Voltage - Isolation: 5000Vrms; Voltage - Output (Max): 35V; Part Number: LTV-817S-TA1; ComponentLink1Description: Datasheet; ComponentLink1URL: http://optoelectronics.liteon.com/upload/download/DS-70-96-0016/LTV-8X7%20series%20201610%20.pdf; ComponentLink2Description: DigiKey Link; ComponentLink2URL: http://digikey.com/product-detail/en/lite-on-inc/LTV-817S-TA1/160-1893-1-ND/3306757; Current - Output / Channel: 50mA; Device Package: 4-SMD, Gull Wing; LastUpdated: 1/12/2020 9:58:48 PM; Lifecycle Status: Active; Minimum Order: 1; Mounting Type: Surface Mount; Operating Temperature: -30°C ~ 110°C; Output Type: Transistor; Package / Case: 4-SMD, Gull Wing; Packaging: TapeAndReel; Part Status: Active; Price: 0.12; Series: -; Supplier 1: DigiKey; Supplier Part Number 1: 160-1893-1-ND; Supplier Device Package: 4-SMD
J2 = 282837-3: TERM BLK 3P SIDE ENT 5.08MM PCB; Manufacturer: TE Connectivity AMP Connectors; Current: 13.5 A; Mating Orientation: Horizontal with Board; Number of Levels: 1; Pitch: 0.200" (5.08mm); Positions Per Level: 3; Voltage: 300 V; Wire Gauge: 16-28 AWG; Wire Termination: Screw - Rising Cage Clamp; Part Number: 282837-3; Color: Green; ComponentLink1Description: Datasheet; ComponentLink1URL: https://www.te.com/commerce/DocumentDelivery/DDEController?Action=srchrtrv&DocNm=282837&DocType=Customer+Drawing&DocLang=English; ComponentLink2Description: DigiKey Link; ComponentLink2URL: https://www.digikey.com/en/products/detail/te-connectivity-amp-connectors/282837-3/2187974; Features: Interlocking (Side); LastUpdated: 6/21/2022 15:00:39; Lifecycle Status: Active; Minimum Order: 1; Mounting Type: Through Hole; Packaging: Tray; Part Status: Active; Price: 0.47; Series: Buchanan; Supplier 1: DigiKey; Supplier Part Number 1: A113321-ND
J3 = 282837-2: as J1 on sheet Power_supply; Part Number: 282837-2; Color: Green; ComponentLink1Description: Datasheet; ComponentLink1URL: https://www.te.com/commerce/DocumentDelivery/DDEController?Action=srchrtrv&DocNm=282837&DocType=Customer+Drawing&DocLang=English; ComponentLink2Description: DigiKey Link; ComponentLink2URL: https://www.digikey.com/en/products/detail/te-connectivity-amp-connectors/282837-2/2187973; Features: Interlocking (Side); LastUpdated: 6/21/2022 3:00:23 PM; Lifecycle Status: Active; Minimum Order: 1; Mounting Type: Through Hole; Packaging: Tray; Part Status: Active; Price: 0.31; Series: Buchanan; Supplier 1: DigiKey; Supplier Part Number 1: A113320-ND
R1 = RT1206BRD07220KL: RES SMD 220K OHM 0.1% 1/4W 1206; Manufacturer: Yageo; Power (Watts): 0.25W, 1/4W; Temperature Coefficient: ±25ppm/°C; Part Number: RT1206BRD07220KL; ComponentLink1Description: Datasheet; ComponentLink1URL: https://www.yageo.com/upload/media/product/productsearch/datasheet/rchip/PYu-RT_1-to-0.01_RoHS_L_11.pdf; ComponentLink2Description: DigiKey Link; ComponentLink2URL: https://www.digikey.com/en/products/detail/yageo/RT1206BRD07220KL/1079638; Composition: Thin Film; Device Package: 1206 (3216 Metric); Height - Seated (Max): 0.026" (0.65mm); LastUpdated: 4/6/2026 8:00:54 PM; Lifecycle Status: Active; Minimum Order: 1; Number of Terminations: 2; Operating Temperature: -55°C ~ 155°C; Package / Case: 1206 (3216 Metric); Packaging: TapeAndReel; PartId: 26865; Part Status: Active; Price: 0.09; Resistance: 220 kOhms; Series: RT; Size / Dimension: 0.122" L x 0.063" W (3.10mm x 1.60mm); Supplier 1: DigiKey; Supplier Part Number 1: YAG5045CT-ND; Supplier Device Package: 1206; Tolerance: ±0.1%; Value: 220 kOhms
R2 R4 = RNCS1206BKE100K: RES 100K OHM 0.1% 1/8W 1206; Manufacturer: Stackpole Electronics Inc; Power (Watts): 0.125W, 1/8W; Temperature Coefficient: ±25ppm/°C; Part Number: RNCS1206BKE100K; ComponentLink1Description: Datasheet; ComponentLink1URL: https://www.seielect.com/catalog/sei-rncs_rnch.pdf; ComponentLink2Description: DigiKey Link; ComponentLink2URL: https://www.digikey.com/en/products/detail/stackpole-electronics-inc/RNCS1206BKE100K/1800321; Composition: Thin Film; Device Package: 1206 (3216 Metric); Features: Anti-Corrosive, Automotive AEC-Q200, Moisture Resistant; Height - Seated (Max): 0.026" (0.65mm); LastUpdated: 4/6/2026 8:00:54 PM; Lifecycle Status: Active; Minimum Order: 1; Number of Terminations: 2; Operating Temperature: -55°C ~ 155°C; Package / Case: 1206 (3216 Metric); Packaging: TapeAndReel; PartId: 26854; Part Status: Active; Price: 0.08; Ratings: AEC-Q200; Resistance: 100 kOhms; Series: RNCS; Size / Dimension: 0.120" L x 0.061" W (3.05mm x 1.55mm); Supplier 1: DigiKey; Supplier Part Number 1: RNCS1206BKE100KCT-ND; Supplier Device Package: 1206; Tolerance: ±0.1%; Value: 100 kOhms
R3 R5 = CRG1206F10K: RES SMD 10K OHM 1% 1/4W 1206; Manufacturer: TE Connectivity Passive Product; Power (Watts): 0.25W, 1/4W; Temperature Coefficient: ±100ppm/°C; Part Number: CRG1206F10K; ComponentLink1Description: Datasheet; ComponentLink1URL: https://www.te.com/commerce/DocumentDelivery/DDEController?Action=srchrtrv&DocNm=1773204&DocType=DS&DocLang=English; ComponentLink2Description: DigiKey Link; ComponentLink2URL: https://www.digikey.com/en/products/detail/te-connectivity-passive-product/CRG1206F10K/2389909; Composition: Thick Film; Device Package: 1206 (3216 Metric); Height - Seated (Max): 0.026" (0.65mm); LastUpdated: 4/6/2026 8:00:52 PM; Lifecycle Status: Active; Minimum Order: 1; Number of Terminations: 2; Operating Temperature: -55°C ~ 155°C; Package / Case: 1206 (3216 Metric); Packaging: TapeAndReel; PartId: 26989; Part Status: Active; Price: 0.01; Resistance: 10 kOhms; Series: CRG, Neohm; Size / Dimension: 0.122" L x 0.061" W (3.10mm x 1.55mm); Supplier 1: DigiKey; Supplier Part Number 1: A106069CT-ND; Supplier Device Package: 1206; Tolerance: ±1%; Value: 10 kOhms
R6 R7 = RT1206BRD072K2L: RES SMD 2.2K OHM 0.1% 1/4W 1206; Manufacturer: Yageo; Power (Watts): 0.25W, 1/4W; Temperature Coefficient: ±25ppm/°C; Part Number: RT1206BRD072K2L; ComponentLink1Description: Datasheet; ComponentLink1URL: https://www.yageo.com/upload/media/product/productsearch/datasheet/rchip/PYu-RT_1-to-0.01_RoHS_L_11.pdf; ComponentLink2Description: DigiKey Link; ComponentLink2URL: https://www.digikey.com/en/products/detail/yageo/RT1206BRD072K2L/1079707; Composition: Thin Film; Device Package: 1206 (3216 Metric); Height - Seated (Max): 0.026" (0.65mm); Lifecycle Status: Active; Minimum Order: 1; Number of Terminations: 2; Operating Temperature: -55°C ~ 155°C; Package / Case: 1206 (3216 Metric); Packaging: TapeAndReel; PartId: 26874; Part Status: Active; Price: 0.09; Resistance: 2.2 kOhms; Series: RT; Size / Dimension: 0.122" L x 0.063" W (3.10mm x 1.60mm); Supplier 1: DigiKey; Supplier Part Number 1: YAG5058CT-ND; Supplier Device Package: 1206; Tolerance: ±0.1%; Value: 2.2 kOhms
  R6: LastUpdated: 4/6/2026 20:00:54
  R7: LastUpdated: 4/6/2026 8:00:54 PM
R8 = AC1206JR-073K3L: RES SMD 3.3K OHM 5% 1/4W 1206; Manufacturer: Yageo; Power (Watts): 0.25W, 1/4W; Temperature Coefficient: ±100ppm/°C; Part Number: AC1206JR-073K3L; ComponentLink1Description: Datasheet; ComponentLink1URL: https://www.yageo.com/upload/media/product/productsearch/datasheet/rchip/PYu-AC_51_RoHS_L_7.pdf; ComponentLink2Description: DigiKey Link; ComponentLink2URL: https://www.digikey.com/en/products/detail/yageo/AC1206JR-073K3L/5897846; Composition: Thick Film; Device Package: 1206 (3216 Metric); Features: Automotive AEC-Q200, Moisture Resistant; Height - Seated (Max): 0.026" (0.65mm); LastUpdated: 4/6/2026 20:00:53; Lifecycle Status: Active; Minimum Order: 1; Number of Terminations: 2; Operating Temperature: -55°C ~ 155°C; Package / Case: 1206 (3216 Metric); Packaging: TapeAndReel; PartId: 26924; Part Status: Active; Price: 0.01; Ratings: AEC-Q200; Resistance: 3.3 kOhms; Series: AC; Size / Dimension: 0.122" L x 0.063" W (3.10mm x 1.60mm); Supplier 1: DigiKey; Supplier Part Number 1: YAG3958CT-ND; Supplier Device Package: 1206; Tolerance: ±5%; Value: 3.3 kOhms
T1 = Bien Tro Tinh Chinh 10K Dung: Cắm; Ma_Hang: MH003232; Ten_Linh_Kien: Biến Trở VR 103-10K 3296W; Don_Vi: Con; Kieu_Chan: *; Chung_Loai: Cắm; Ghi_Chu: *
U7 = LM358APE4: Dual, 30-V, 700-kHz operational amplifier 8-PDIP 0 to 70; Manufacturer_Name: Texas Instruments; Copyright: Copyright (C) 2025 Ultra Librarian. All rights reserved.; Manufacturer_Part_Number: LM358APE4; RefDes: RefDes; Type: Type
U8 = LM393P: Dual differential comparator, commercial grade 8-PDIP 0 to 70; Manufacturer_Name: Texas Instruments; Copyright: Copyright (C) 2026 Ultra Librarian. All rights reserved.; Manufacturer_Part_Number: LM393P; RefDes: RefDes; Type: Type

## Nets that join several sheets
+5: Power_supply (C18.2 D7.1 U6.3), Signal_conditioning (R7.1)
+24: Power_supply (8 pins), Signal_conditioning (R8.1)
-24: Power_supply (6 pins), Signal_conditioning (J2.1)
COM: Power_supply (19 pins), Signal_conditioning (11 pins)
+15VDC: Power_supply (C14.2 D3.1 U4.3), Signal_conditioning (5 pins)
-15VDC: Power_supply (C16.2 R10.2 U5.3), Signal_conditioning (5 pins)